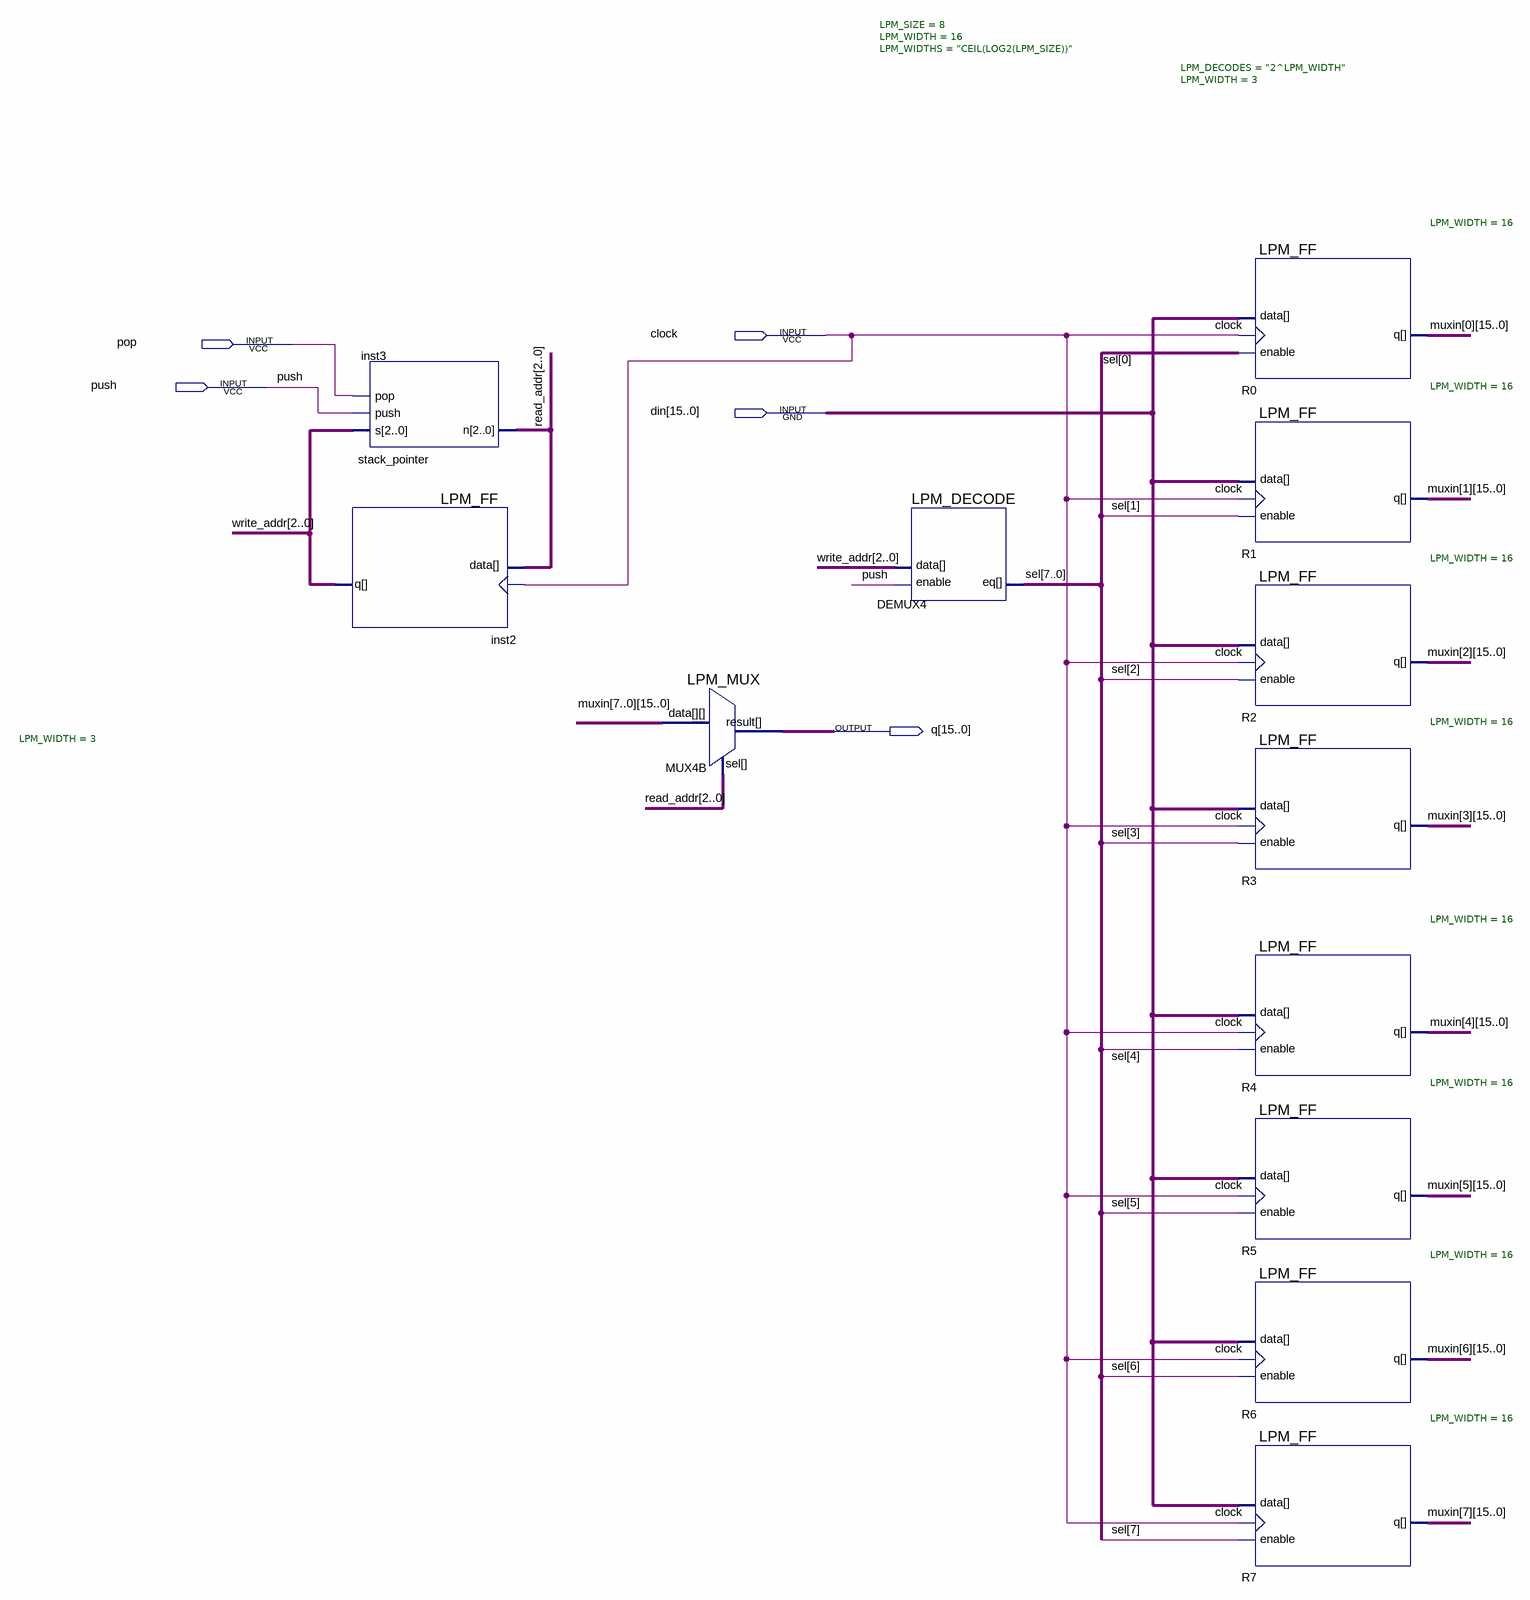
[diagram p0: schematic sheet]
// Quartus schematic stack.bdf as structural Verilog: 12 symbols, 5 pins
module stack (
  input  clock,
  input  pop,
  input  push,
  input  [15:0] din,
  output [15:0] q
);

  wire [2:0] read_addr, write_addr;
  wire [7:0] sel;
  wire [15:0] muxin_0, muxin_1, muxin_2, muxin_3, muxin_4, muxin_5, muxin_6, muxin_7;

  stack_pointer inst3 (.s(write_addr), .push(push), .pop(pop), .n(read_addr));
  LPM_FF #(.LPM_WIDTH(3)) inst2 (.clock(clock), .data(read_addr), .q(write_addr));
  LPM_MUX #(.LPM_SIZE(8), .LPM_WIDTH(16), .LPM_WIDTHS("CEIL(LOG2(LPM_SIZE))")) MUX4B (
    .data({muxin_7, muxin_6, muxin_5, muxin_4, muxin_3, muxin_2, muxin_1, muxin_0}), .sel(read_addr),
    .result(q));
  LPM_DECODE #(.LPM_DECODES("2^LPM_WIDTH"), .LPM_WIDTH(3)) DEMUX4 (.data(write_addr), .enable(push), .eq(sel));
  LPM_FF #(.LPM_WIDTH(16)) R0 (.clock(clock), .data(din), .enable(sel[0]), .q(muxin_0));
  LPM_FF #(.LPM_WIDTH(16)) R1 (.clock(clock), .data(din), .enable(sel[1]), .q(muxin_1));
  LPM_FF #(.LPM_WIDTH(16)) R2 (.clock(clock), .data(din), .enable(sel[2]), .q(muxin_2));
  LPM_FF #(.LPM_WIDTH(16)) R3 (.clock(clock), .data(din), .enable(sel[3]), .q(muxin_3));
  LPM_FF #(.LPM_WIDTH(16)) R4 (.clock(clock), .data(din), .enable(sel[4]), .q(muxin_4));
  LPM_FF #(.LPM_WIDTH(16)) R5 (.clock(clock), .data(din), .enable(sel[5]), .q(muxin_5));
  LPM_FF #(.LPM_WIDTH(16)) R6 (.clock(clock), .data(din), .enable(sel[6]), .q(muxin_6));
  LPM_FF #(.LPM_WIDTH(16)) R7 (.clock(clock), .data(din), .enable(sel[7]), .q(muxin_7));
endmodule
